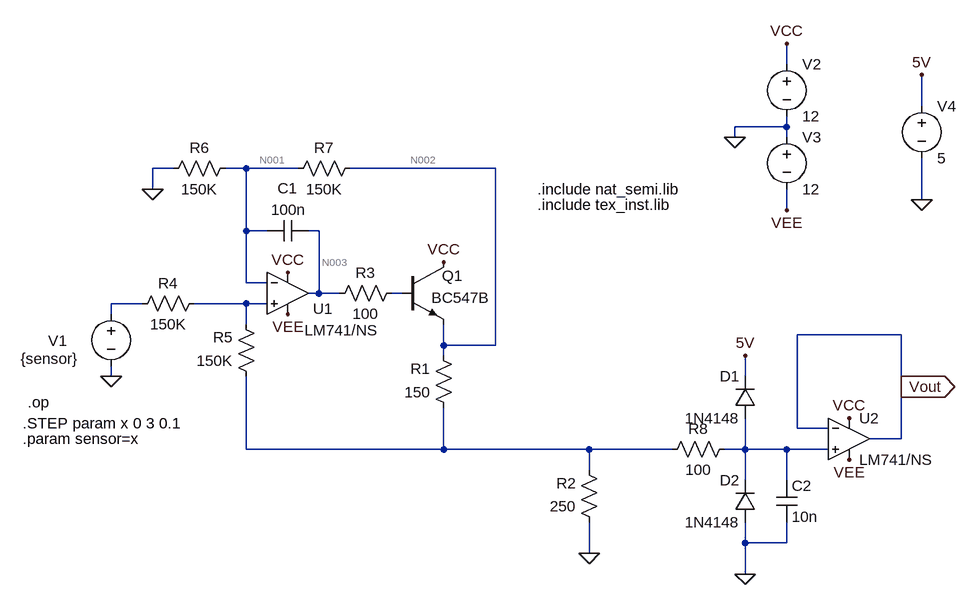
[diagram p0: schematic Draft1.asc]
Draft1.asc, the LTspice schematic file:
Version 4
SHEET 1 936 680
WIRE 672 -208 672 -240
WIRE 880 -144 880 -192
WIRE 672 -112 672 -128
WIRE 672 -112 592 -112
WIRE 592 -96 592 -112
WIRE 672 -96 672 -112
WIRE -272 -48 -304 -48
WIRE -160 -48 -192 -48
WIRE -80 -48 -160 -48
WIRE 224 -48 0 -48
WIRE -304 -16 -304 -48
WIRE 880 0 880 -64
WIRE 672 16 672 -16
WIRE -160 48 -160 -48
WIRE -128 48 -160 48
WIRE -48 48 -64 48
WIRE -160 128 -160 48
WIRE -128 128 -160 128
WIRE -48 144 -48 48
WIRE -48 144 -64 144
WIRE -16 144 -48 144
WIRE 80 144 64 144
WIRE -320 160 -368 160
WIRE -160 160 -240 160
WIRE -128 160 -160 160
WIRE -368 176 -368 160
WIRE -160 192 -160 160
WIRE 848 208 688 208
WIRE 144 224 144 192
WIRE 224 224 224 -48
WIRE 224 224 144 224
WIRE 144 240 144 224
WIRE -368 272 -368 256
WIRE 608 272 608 240
WIRE 848 288 848 208
WIRE 688 352 688 208
WIRE 736 352 688 352
WIRE 848 368 848 288
WIRE 848 368 800 368
WIRE -160 384 -160 272
WIRE 144 384 144 320
WIRE 144 384 -160 384
WIRE 368 384 144 384
WIRE 496 384 368 384
WIRE 608 384 608 336
WIRE 608 384 576 384
WIRE 672 384 608 384
WIRE 736 384 672 384
WIRE 368 416 368 384
WIRE 608 432 608 384
WIRE 672 432 672 384
WIRE 608 528 608 496
WIRE 672 528 672 496
WIRE 672 528 608 528
WIRE 368 544 368 496
WIRE 608 576 608 528
FLAG 368 544 0
FLAG 672 16 VEE
FLAG -96 176 VEE
FLAG 672 -240 VCC
FLAG -96 112 VCC
FLAG -304 -16 0
FLAG 144 96 VCC
FLAG -368 272 0
FLAG 592 -96 0
FLAG 608 576 0
FLAG 768 336 VCC
FLAG 768 400 VEE
FLAG 880 0 0
FLAG 880 -192 5V
FLAG 848 288 Vout
IOPIN 848 288 Out
FLAG 608 240 5V
SYMBOL OpAmps\\opamp2 -96 80 R0
WINDOW 0 39 88 Left 2
WINDOW 3 26 121 Left 2
SYMATTR InstName U1
SYMATTR Value LM741/NS
SYMBOL npn 80 96 R0
WINDOW 0 61 21 Left 2
WINDOW 3 45 55 Left 2
SYMATTR InstName Q1
SYMATTR Value BC547B
SYMBOL res 160 336 R180
WINDOW 0 36 76 Left 2
WINDOW 3 36 40 Left 2
SYMATTR InstName R1
SYMATTR Value 150
SYMBOL res 384 512 R180
WINDOW 0 36 76 Left 2
WINDOW 3 36 40 Left 2
SYMATTR InstName R2
SYMATTR Value 250
SYMBOL res 80 128 R90
WINDOW 0 0 56 VBottom 2
WINDOW 3 32 56 VTop 2
SYMATTR InstName R3
SYMATTR Value 100
SYMBOL voltage -368 160 R0
WINDOW 0 -97 57 Left 2
WINDOW 3 -139 85 Left 2
SYMATTR InstName V1
SYMATTR Value {sensor}
SYMBOL voltage 672 -224 R0
SYMATTR InstName V2
SYMATTR Value 12
SYMBOL voltage 672 -112 R0
SYMATTR InstName V3
SYMATTR Value 12
SYMBOL res -224 144 R90
WINDOW 0 0 56 VBottom 2
WINDOW 3 32 56 VTop 2
SYMATTR InstName R4
SYMATTR Value 150K
SYMBOL res -144 288 R180
WINDOW 0 36 76 Left 2
WINDOW 3 36 40 Left 2
SYMATTR InstName R5
SYMATTR Value 150K
SYMBOL cap -64 32 R90
WINDOW 0 -34 32 VBottom 2
WINDOW 3 -32 31 VTop 2
SYMATTR InstName C1
SYMATTR Value 100n
SYMBOL res -176 -64 R90
WINDOW 0 0 56 VBottom 2
WINDOW 3 32 56 VTop 2
SYMATTR InstName R6
SYMATTR Value 150K
SYMBOL res 16 -64 R90
WINDOW 0 0 56 VBottom 2
WINDOW 3 32 56 VTop 2
SYMATTR InstName R7
SYMATTR Value 150K
SYMBOL res 592 368 R90
WINDOW 0 0 56 VBottom 2
WINDOW 3 32 56 VTop 2
SYMATTR InstName R8
SYMATTR Value 100
SYMBOL diode 624 336 R180
WINDOW 0 24 64 Left 2
WINDOW 3 24 0 Left 2
SYMATTR InstName D1
SYMATTR Value 1N4148
SYMBOL diode 624 496 R180
WINDOW 0 24 64 Left 2
WINDOW 3 24 0 Left 2
SYMATTR InstName D2
SYMATTR Value 1N4148
SYMBOL cap 656 432 R0
SYMATTR InstName C2
SYMATTR Value 10n
SYMBOL Opamps\\opamp2 768 304 R0
SYMATTR InstName U2
SYMATTR Value LM741/NS
SYMBOL voltage 880 -160 R0
SYMATTR InstName V4
SYMATTR Value 5
TEXT 288 -16 Left 2 !.include nat_semi.lib
TEXT 288 8 Left 2 !.include tex_inst.lib
TEXT -504 344 Left 2 !.STEP param x 0 3 0.1
TEXT -496 312 Left 2 !.op
TEXT -504 368 Left 2 !.param sensor=x

The netlist it stands for:
* Draft1.asc
XU1 N006 N001 VCC VEE N003 LM741/NS  ; pins In+ In- V+ V- OUT
Q1 VCC N004 N002 0 BC547B
R1 N007 N002 150
R2 0 N007 250
R3 N004 N003 100
V1 N005 0 {sensor}
V2 VCC 0 12
V3 0 VEE 12
R4 N006 N005 150K
R5 N007 N006 150K
C1 N003 N001 100n
R6 N001 0 150K
R7 N002 N001 150K
R8 N008 N007 100
D1 N008 5V 1N4148
D2 0 N008 1N4148
C2 N008 0 10n
XU2 N008 Vout VCC VEE Vout LM741/NS  ; pins In+ In- V+ V- OUT
V4 5V 0 5
.model D D
.lib standard.dio
.model NPN NPN
.model PNP PNP
.lib standard.bjt
.include nat_semi.lib
.include tex_inst.lib
.STEP param x 0 3 0.1
.op
.param sensor=x
.backanno
.end

* Results of the author's LTspice run, read from the files saved beside the schematic
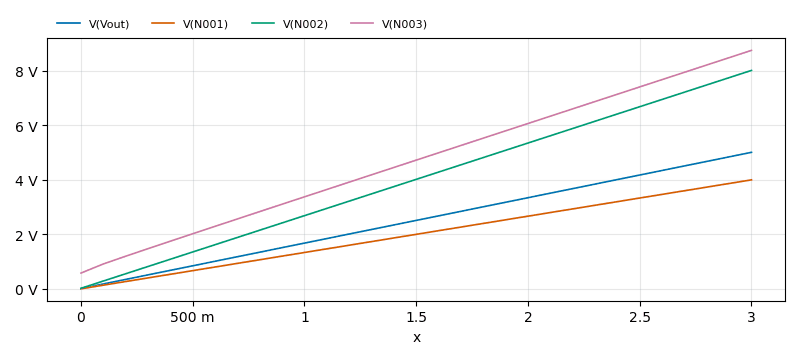
[diagram p1: Operating Point of Draft1.asc, plotted from the saved traces]
* Operating Point, 1 run:
*   V(Vout): 15.28 mV at x=0, 5.014 V at x=3 , min 15.28 mV, max 5.014 V
*   V(N001): 3.8 mV at x=0, 4.003 V at x=3 , min 3.8 mV, max 4.003 V
*   V(N002): 22.88 mV at x=0, 8.022 V at x=3 , min 22.88 mV, max 8.022 V
*   V(N003): 582.1 mV at x=0, 8.758 V at x=3 , min 582.1 mV, max 8.758 V